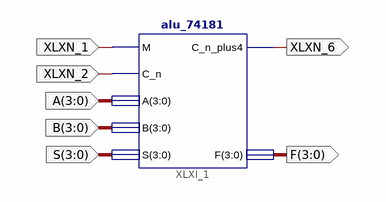
[diagram p0: schematic sheet 1]
// Xilinx ISE schematic pro1.sch (spartan6) as structural Verilog: 1 symbols, 7 ports
module pro1 (
  input  XLXN_1,
  input  XLXN_2,
  input  [3:0] A,
  input  [3:0] B,
  input  [3:0] S,
  output XLXN_6,
  output [3:0] F
);

  alu_74181 XLXI_1 (.M(XLXN_1), .C_n(XLXN_2), .A(A), .B(B), .S(S), .C_n_plus4(XLXN_6), .F(F));
endmodule
